# EAGLE design Transistors (EAGLE 6.1)
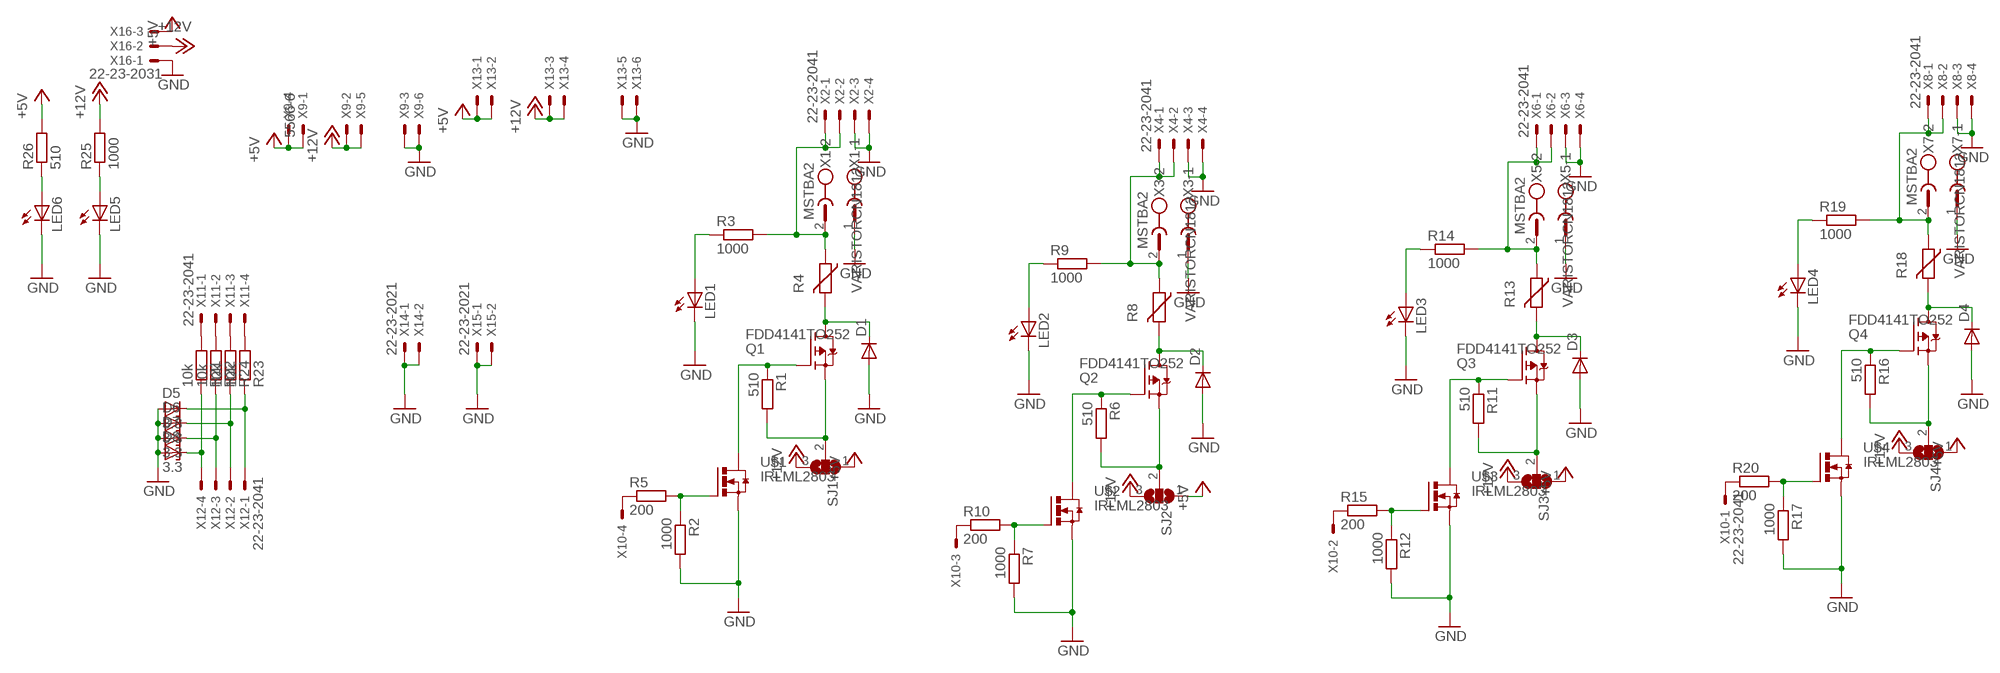
[diagram p0: schematic, sheet 1]

## Parts
D1  DIODE-SMB  [SMB]
D2  DIODE-SMB  [SMB]
D3  DIODE-SMB  [SMB]
D4  DIODE-SMB  [SMB]
D5  3.3  ZENER-DIODESOD80C  [SOD80C]
D6  3.3  ZENER-DIODESOD80C  [SOD80C]
D7  3.3  ZENER-DIODESOD80C  [SOD80C]
D8  3.3  ZENER-DIODESOD80C  [SOD80C]
LED1  LEDCHIPLED_1206  [CHIPLED_1206]
LED2  LEDCHIPLED_1206  [CHIPLED_1206]
LED3  LEDCHIPLED_1206  [CHIPLED_1206]
LED4  LEDCHIPLED_1206  [CHIPLED_1206]
LED5  LEDCHIPLED_1206  [CHIPLED_1206]
LED6  LEDCHIPLED_1206  [CHIPLED_1206]
Q1  FDD4141TO252  [TO252]
Q2  FDD4141TO252  [TO252]
Q3  FDD4141TO252  [TO252]
Q4  FDD4141TO252  [TO252]
R1  510  R-EU_M0805  [M0805]
R2  1000  R-EU_M0805  [M0805]
R3  1000  R-EU_M0805  [M0805]
R4  VARISTORCN1812  [CT/CN1812]
R5  200  R-EU_M0805  [M0805]
R6  510  R-EU_M0805  [M0805]
R7  1000  R-EU_M0805  [M0805]
R8  VARISTORCN1812  [CT/CN1812]
R9  1000  R-EU_M0805  [M0805]
R10  200  R-EU_M0805  [M0805]
R11  510  R-EU_M0805  [M0805]
R12  1000  R-EU_M0805  [M0805]
R13  VARISTORCN1812  [CT/CN1812]
R14  1000  R-EU_M0805  [M0805]
R15  200  R-EU_M0805  [M0805]
R16  510  R-EU_M0805  [M0805]
R17  1000  R-EU_M0805  [M0805]
R18  VARISTORCN1812  [CT/CN1812]
R19  1000  R-EU_M0805  [M0805]
R20  200  R-EU_M0805  [M0805]
R21  10k  R-EU_M0805  [M0805]
R22  10k  R-EU_M0805  [M0805]
R23  10k  R-EU_M0805  [M0805]
R24  10k  R-EU_M0805  [M0805]
R25  1000  R-EU_M0805  [M0805]
R26  510  R-EU_M0805  [M0805]
SJ1  SJ2W  [SJ_2]
SJ2  SJ2W  [SJ_2]
SJ3  SJ2W  [SJ_2]
SJ4  SJ2W  [SJ_2]
U$1  IRLML2803  [SUPER-SOT3]
U$2  IRLML2803  [SUPER-SOT3]
U$3  IRLML2803  [SUPER-SOT3]
U$4  IRLML2803  [SUPER-SOT3]
X1  MSTBA2  [MSTBA2]
X2  22-23-2041  [22-23-2041]
X3  MSTBA2  [MSTBA2]
X4  22-23-2041  [22-23-2041]
X5  MSTBA2  [MSTBA2]
X6  22-23-2041  [22-23-2041]
X7  MSTBA2  [MSTBA2]
X8  22-23-2041  [22-23-2041]
X9  5566-6  [5566-6]
X10  22-23-2041  [22-23-2041]
X11  22-23-2041  [22-23-2041]
X12  22-23-2041  [22-23-2041]
X13  22-23-2061  [22-23-2061]
X14  22-23-2021  [22-23-2021]
X15  22-23-2021  [22-23-2021]
X16  22-23-2031  [22-23-2031]

## Nets
+5V: R26.2 SJ1.1 SJ2.1 SJ3.1 SJ4.1 X9.1 X9.4 X13.1 X13.2 X16.3
+12V: R25.2 SJ1.3 SJ2.3 SJ3.3 SJ4.3 X9.2 X9.5 X13.3 X13.4 X16.2
GND: D1.A D2.A D3.A D4.A D5.A D6.A D7.A D8.A LED1.C LED2.C LED3.C LED4.C LED5.C LED6.C R2.2 R7.2 R12.2 R17.2 U$1.2(S) U$2.2(S) U$3.2(S) U$4.2(S) X1.1 X2.3 X2.4 X3.1 X4.3 X4.4 X5.1 X6.3 X6.4 X7.1 X8.3 X8.4 X9.3 X9.6 X13.5 X13.6 X14.1 X14.2 X15.1 X15.2 X16.1
N$1: Q1.2(S) R1.2 SJ1.2
N$2: Q1.1(G) R1.1 U$1.3(D)
N$3: R2.1 R5.2 U$1.1(G)
N$4: R5.1 X10.4
N$5: LED1.A R3.1
N$6: R10.1 X10.3
N$7: Q2.2(S) R6.2 SJ2.2
N$8: Q2.1(G) R6.1 U$2.3(D)
N$9: R7.1 R10.2 U$2.1(G)
N$10: R15.1 X10.2
N$11: R20.1 X10.1
N$12: LED2.A R9.1
N$13: Q3.2(S) R11.2 SJ3.2
N$14: Q3.1(G) R11.1 U$3.3(D)
N$15: R12.1 R15.2 U$3.1(G)
N$16: R21.2 X11.1
N$17: R22.2 X11.2
N$18: LED3.A R14.1
N$19: Q4.2(S) R16.2 SJ4.2
N$20: Q4.1(G) R16.1 U$4.3(D)
N$21: R17.1 R20.2 U$4.1(G)
N$22: R23.2 X11.4
N$23: R24.2 X11.3
N$24: LED4.A R19.1
N$26: LED6.A R26.1
N$27: LED5.A R25.1
N$29: D8.C R21.1 X12.4
N$30: D6.C R24.1 X12.2
N$32: D5.C R23.1 X12.1
N$33: D7.C R22.1 X12.3
OUT1: R3.2 R4.1 X1.2 X2.1 X2.2
OUT2: R8.1 R9.2 X3.2 X4.1 X4.2
OUT3: R13.1 R14.2 X5.2 X6.1 X6.2
OUT4: R18.1 R19.2 X7.2 X8.1 X8.2
TH1: D1.C Q1.3(D) R4.2
TH2: D2.C Q2.3(D) R8.2
TH3: D3.C Q3.3(D) R13.2
TH4: D4.C Q4.3(D) R18.2

## Library data of the parts
D1-D4 = diode:DIODE-: DIODE
D5-D8 = diode:ZENER-DIODE: Z-Diode
LED1-LED6 = led:LED: LED OSRAM: - CHIPLED LG R971, LG N971, LY N971, LG Q971, LY Q971, LO R971, LY R971 LH N974, LH R974 LS Q976, LO Q976, LY Q976 LO Q996 - Hyper CHIPLED LW Q18S LB Q993, LB Q99A, LB R99A - SideLED LS A670, LO A670, LY A670, LG A670, LP A670 LB A673, LV A673, LT A673, LW A673 LH A674 LY A675 LS A676, LA A676, LO A676, LY A676, LW A676 LS A679, LY A679, LG A679 - Hyper Micro SIDELED® LS Y876, LA Y876, LO Y876, LY Y876 LT Y87S - SmartLED LW L88C, LW L88S LB L89C, LB L89S, LG L890 LS L89K, LO L89K, LY L89K LS L896, LA L896, LO L896, LY L896 - TOPLED LS T670, LO T670, LY T670, LG T670, LP T670 LSG T670, LSP T670, LSY T670, LOP T670, LYG T670 LG T671, LOG T671, LSG T671 LB T673, LV T673, LT T673, LW T673 LH T674 LS T676, LA T676, LO T676, LY T676, LB T676, LH T676, LSB T676, LW T676 LB T67C, LV T67C, LT T67C, LS T67K, LO T67K, LY T67K, LW E67C LS E67B, LA E67B, LO E67B, LY E67B, LB E67C, LV E67C, LT E67C LW T67C LS T679, LY T679, LG T679 LS T770, LO T770, LY T770, LG T770, LP T770 LB T773, LV T773, LT T773, LW T773 LH T774 LS E675, LA E675, LY E675, LS T675 LS T776, LA T776, LO T776, LY T776, LB T776 LHGB T686 LT T68C, LB T68C - Hyper Mini TOPLED® LB M676 - Mini TOPLED Santana® LG M470 LS M47K, LO M47K, LY M47K Source: http://www.osram.convergy.de LUXEON: - LUMILED® LXK2-PW12-R00, LXK2-PW12-S00, LXK2-PW14-U00, LXK2-PW14-V00 LXK2-PM12-R00, LXK2-PM12-S00, LXK2-PM14-U00 LXK2-PE12-Q00, LXK2-PE12-R00, LXK2-PE12-S00, LXK2-PE14-T00, LXK2-PE14-U00 LXK2-PB12-K00, LXK2-PB12-L00, LXK2-PB12-M00, LXK2-PB14-N00, LXK2-PB14-P00, LXK2-PB14-Q00 LXK2-PR12-L00, LXK2-PR12-M00, LXK2-PR14-Q00, LXK2-PR14-R00 LXK2-PD12-Q00, LXK2-PD12-R00, LXK2-PD12-S00 LXK2-PH12-R00, LXK2-PH12-S00 LXK2-PL12-P00, LXK2-PL12-Q00, LXK2-PL12-R00 Source: www.luxeon.com KINGBRIGHT: KA-3528ASYC Source: www.kingbright.com
Q1-Q4 = transistor-fet:FDD4141: P-Channel PowerTrench® MOSFET Source: FDD4141.pdf
R1-R3 R5-R7 R9-R12 R14-R17 R19-R26 = rcl:R-EU_: RESISTOR, European symbol
R4 R8 R13 R18 = varistor:VARISTOR: VARISTOR
SJ1-SJ4 = jumper:SJ2W: SMD solder JUMPER
U$1-U$4 = transistor-power:IRLML2803
X1 X3 X5 X7 = con-phoenix-508:MSTBA2: PHOENIX; MF: FARNELL; MPN: 1757242; OC_FARNELL: 3705171; OC_NEWARK: 71C4161
X2 X4 X6 X8 X10-X12 = con-molex:22-23-2041: .100" (2.54mm) Center Header - 4 Pin; MF: MOLEX; MPN: 22-23-2041; OC_FARNELL: 1462920; OC_NEWARK: 38C0355
X9 = con-molex:5566-6: Mini FIT connector 6 pol Source: http://www.molex.com; MPN: 95566-61002; OC_FARNELL: unknown; OC_NEWARK: 22K8620
X13 = con-molex:22-23-2061: .100" (2.54mm) Center Header - 6 Pin; MF: MOLEX; MPN: 22-23-2061; OC_FARNELL: 1462922; OC_NEWARK: 27C1933
X14 X15 = con-molex:22-23-2021: .100" (2.54mm) Center Header - 2 Pin; MF: MOLEX; MPN: 22-23-2021; OC_FARNELL: 1462926; OC_NEWARK: 25C3832
X16 = con-molex:22-23-2031: .100" (2.54mm) Center Header - 3 Pin; MF: MOLEX; MPN: 22-23-2031; OC_FARNELL: 1462950; OC_NEWARK: 30C0862

## Board
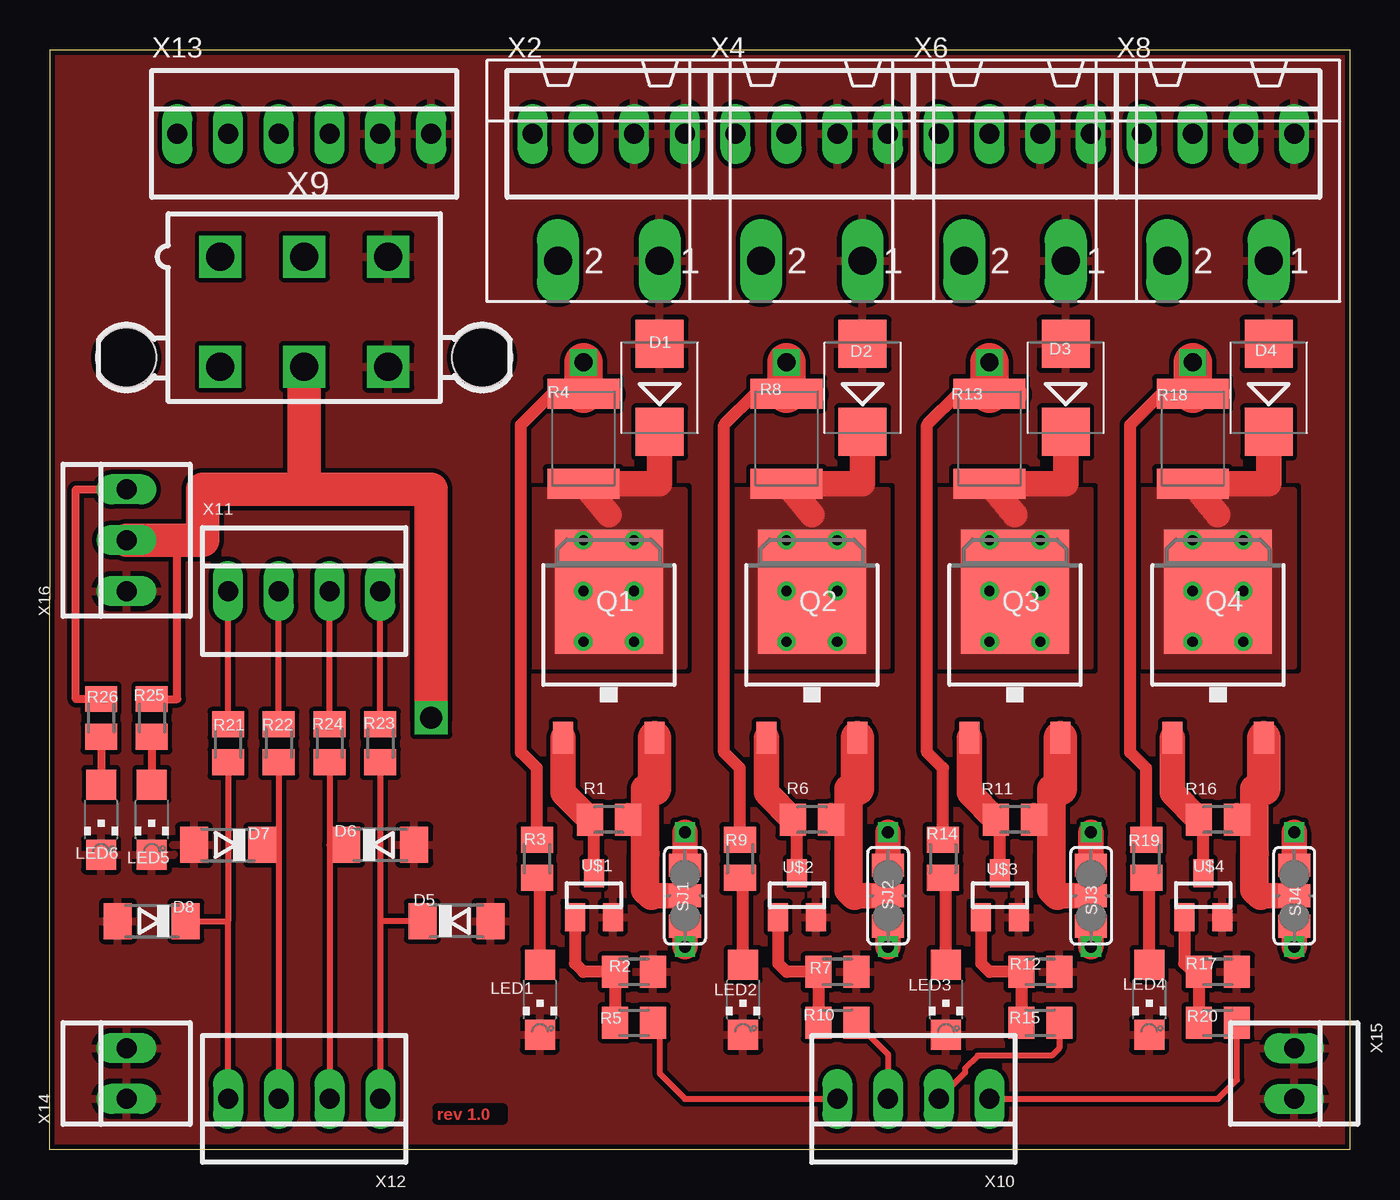
[diagram p1: board, top side]
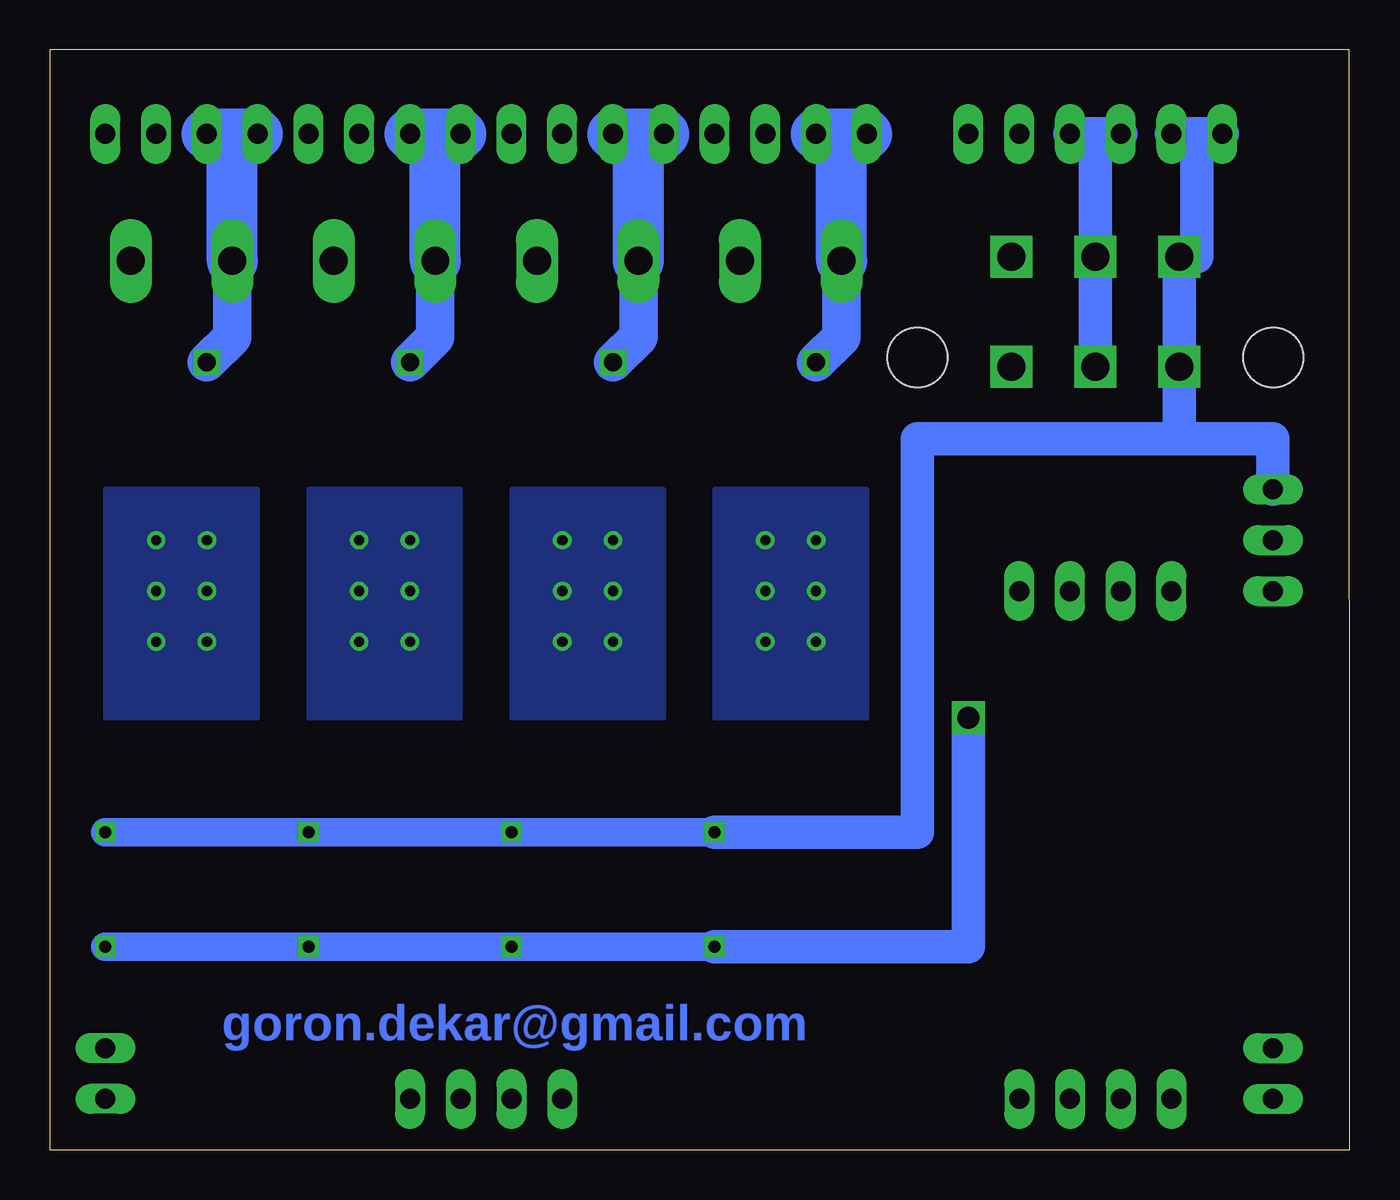
[diagram p2: board, bottom side, seen from below]

Size 65.02 x 55 mm. Coordinates in mm from the lower left corner, seen from the top.
Outline: 65.02,0 0,0 0.02,55 65.02,55 65.02,0
Copper layers (1+16): Top 0.0178mm / dielectric 1.5011mm / Bottom 0.0178mm
Design rules: minimum track width 0.22mm, minimum drill 0.3mm, track to track 0.22mm, track to pad 0.22mm, pad to pad 0.22mm, via to via 0.22mm, smd to smd 0mil, copper to edge 0.25mm, drill to drill 0.22mm, minimum pad ring 10mil, minimum via ring 8mil, stop-mask expansion 4mil, vias tented up to drill 0.5mm, thermal gap 10mil

### Footprints (pad centres in the part's own frame; a part is rotated, then mirrored left to right if it is on the bottom)
SMB = smd 2.4 x 2.4: A 2.2,0; C -2.2,0
SOD80C = smd 1.4 x 1.8: A 1.7,0; C -1.7,0
CHIPLED_1206 = smd 1.5 x 1.5: A 0,-1.75; C 0,1.75
TO252 = smd 1 x 1.6: 1 -2.28,-4.8; 2 2.28,-4.8 | smd 5.4 x 6.2: 3 0,2.5
M0805 = smd 1.3 x 1.6: 1 -0.95,0; 2 0.95,0
CT/CN1812 = smd 1.5 x 3.6: 1 -2.25,0; 2 2.25,0
SJ_2 = smd 1.168 x 1.6: 1 -1.524,0; 2 0,0; 3 1.524,0
SUPER-SOT3 = smd 1 x 1.4: 1 -0.95,-1.1; 2 0.95,-1.1; 3 0,1.1
MSTBA2 = drill 1.397 long: 1 -2.54,5.08; 2 2.54,5.08
22-23-2041 = drill 1 long: 1 -3.81,0; 2 -1.27,0; 3 1.27,0; 4 3.81,0
5566-6 = drill 1.4 square: 1 4.2,-2.75; 2 0,-2.75; 3 -4.2,-2.75; 4 4.2,2.75; 5 0,2.75; 6 -4.2,2.75 | hole 3: 8.9,2.29; -8.9,2.29
22-23-2061 = drill 1 long: 1 -6.35,0; 2 -3.81,0; 3 -1.27,0; 4 1.27,0; 5 3.81,0; 6 6.35,0
22-23-2021 = drill 1 long: 1 -1.27,0; 2 1.27,0
22-23-2031 = drill 1 long: 1 -2.54,0; 2 0,0; 3 2.54,0

### Placement (x,y rotation side)
D1  30.5,38.1 90 top
D2  40.66,38.1 90 top
D3  50.82,38.1 90 top
D4  60.98,38.1 90 top
D5  20.34,11.43 0 top
D6  16.53,15.24 0 top
D7  8.91,15.24 180 top
D8  5.1,11.43 180 top
LED1  24.51,7.5 180 top
LED2  34.67,7.5 180 top
LED3  44.83,7.5 180 top
LED4  54.99,7.5 180 top
LED5  5.1,16.51 180 top
LED6  2.56,16.51 180 top
Q1  27.96,25.4 0 top
Q2  38.12,25.4 0 top
Q3  48.28,25.4 0 top
Q4  58.44,25.4 0 top
R1  27.96,16.51 0 top
R2  29.23,8.89 0 top
R3  24.36,14.55 90 top
R4  26.69,35.56 270 top
R5  29.23,6.35 180 top
R6  38.12,16.51 0 top
R7  39.39,8.89 0 top
R8  36.85,35.56 270 top
R9  34.52,14.55 90 top
R10  39.39,6.35 180 top
R11  48.28,16.51 0 top
R12  49.55,8.89 0 top
R13  47.01,35.56 270 top
R14  44.68,14.55 90 top
R15  49.55,6.35 180 top
R16  58.44,16.51 0 top
R17  58.44,8.89 0 top
R18  57.17,35.56 270 top
R19  54.84,14.55 90 top
R20  58.44,6.35 180 top
R21  8.91,20.32 90 top
R22  11.45,20.32 90 top
R23  16.53,20.32 90 top
R24  13.99,20.32 90 top
R25  5.1,21.59 90 top
R26  2.56,21.59 90 top
SJ1  31.77,12.7 270 top
SJ2  41.93,12.7 270 top
SJ3  52.09,12.7 270 top
SJ4  62.25,12.7 270 top
U$1  27.22,12.73 0 top
U$2  37.38,12.73 0 top
U$3  47.54,12.73 0 top
U$4  57.7,12.73 0 top
X1  27.96,49.53 180 top
X2  27.96,50.8 0 top
X3  38.12,49.53 180 top
X4  38.12,50.8 0 top
X5  48.28,49.53 180 top
X6  48.28,50.8 0 top
X7  58.44,49.53 180 top
X8  58.44,50.8 0 top
X9  12.72,41.91 180 top
X10  43.2,2.54 180 top
X11  12.72,27.94 0 top
X12  12.72,2.54 180 top
X13  12.72,50.8 0 top
X14  3.83,3.81 90 top
X15  62.25,3.81 270 top
X16  3.83,30.48 90 top

### Tracks (layer width: path | path; a pad name or v marks a point on that pad's centre or on a via)
+5V  (via drill 0.6)
  Top 0.406: R26.2 1.29,22.54 1.29,33.02 X16.3
  Top 1.27: SJ1.1 v31.77,15.88 | v62.25,15.88 SJ4.1 | SJ3.1 v52.09,15.88 | SJ2.1 v41.93,15.88
  Bottom 1.422: v31.77,15.88 v41.93,15.88 v52.09,15.88 v62.25,15.88
  Bottom 1.676: 7.64,50.8 7.64,44.66 X9.1 X9.4 8.52,35.56 | 7.64,50.8 X13.1 | X13.2 7.64,50.8 | v31.77,15.88 21.61,15.88 21.61,35.56 8.52,35.56 | X16.3 3.83,35.56 8.52,35.56
+12V  (via drill 0.6, 1.1)
  Top 0.406: R25.2 6.37,22.54 6.37,30.48
  Top 1.27: SJ1.3 v31.77,10.16 | SJ2.3 v41.93,10.16 | SJ3.3 v52.09,10.16 | SJ4.3 v62.25,10.16
  Top 1.676: X9.5 12.72,33.02 | 12.72,33.02 19.07,33.02 v19.07,21.59 | X16.2 6.37,30.48 7.64,30.48 7.64,33.02 12.72,33.02
  Bottom 1.422: v52.09,10.16 v41.93,10.16 v31.77,10.16 v52.09,10.16 | v62.25,10.16 v52.09,10.16
  Bottom 1.676: X9.5 X9.2 12.72,50.8 | X13.3 12.72,50.8 | X13.4 12.72,50.8 | v19.07,21.59 19.07,10.16 v31.77,10.16
GND
  pour Top (rank 2): 0.02,55 65.02,55 65.02,0 0.02,0
N$1
  Top 0.406: R1.2 29.78,16.51
  Top 1.27: R1.2 28.91,16.71 | SJ1.2 30.09,12.7
  Top 1.422: 30.09,12.7 29.78,13.01 29.78,14.8 | 29.78,14.8 29.79,14.81 | 29.78,14.8 29.78,16.51 29.78,18.04 30.24,18.04
  Top 1.676: Q1.2 30.24,18.04
N$2
  Top 0.61: U$1.3 27.22,16.3 R1.1
  Top 1.27: Q1.1 25.68,17.84 R1.1
N$3
  Top 0.61: U$1.1 26.27,9.31 26.69,8.89 R2.1 R5.2
N$4
  Top 0.305: R5.1 30.5,6.03 30.5,3.81 31.77,2.54 X10.4
N$5
  Top 0.61: LED1.A 24.51,13.45 R3.1
N$6
  Top 0.305: R10.1 41.93,4.76 X10.3
N$7
  Top 0.406: R6.2 39.94,16.51
  Top 1.27: R6.2 39.07,16.71 | SJ2.2 40.25,12.7
  Top 1.422: 40.25,12.7 39.94,13.01 39.94,14.8 | 39.94,14.8 39.95,14.81 | 39.94,14.8 39.94,16.51 39.94,18.04 40.4,18.04
  Top 1.676: Q2.2 40.4,18.04
N$8
  Top 0.61: U$2.3 37.38,16.3 R6.1
  Top 1.27: Q2.1 35.84,17.84 R6.1
N$9
  Top 0.61: U$2.1 36.43,9.31 36.85,8.89 R7.1 R10.2
N$10
  Top 0.305: R15.1 50.5,5.08 50.13,4.71 46.43,4.71 45.78,4.07 45.78,3.85 X10.2
N$11
  Top 0.305: X10.1 58.44,2.54 59.39,3.49 R20.1
N$12
  Top 0.61: LED2.A 34.67,13.45 R9.1
N$13
  Top 0.406: R11.2 50.1,16.51
  Top 1.27: R11.2 49.23,16.71 | SJ3.2 50.41,12.7
  Top 1.422: 50.41,12.7 50.1,13.01 50.1,14.8 | 50.1,14.8 50.11,14.81 | 50.1,14.8 50.1,16.51 50.1,18.04 50.56,18.04
  Top 1.676: Q3.2 50.56,18.04
N$14
  Top 0.61: U$3.3 47.54,16.3 R11.1
  Top 1.27: Q3.1 46,17.84 R11.1
N$15
  Top 0.61: U$3.1 46.59,9.31 47.01,8.89 R12.1 R15.2
N$16
  Top 0.305: R21.2 X11.1
N$17
  Top 0.305: R22.2 X11.2
N$18
  Top 0.61: LED3.A 44.83,13.45 R14.1
N$19
  Top 0.406: R16.2 60.26,16.51
  Top 1.27: R16.2 59.39,16.71 | SJ4.2 60.57,12.7
  Top 1.422: 60.57,12.7 60.26,13.01 60.26,14.8 | 60.26,14.8 60.27,14.81 | 60.26,14.8 60.26,16.51 60.26,18.04 60.72,18.04
  Top 1.676: Q4.2 60.72,18.04
N$20
  Top 0.61: U$4.3 57.7,16.3 R16.1
  Top 1.27: Q4.1 56.16,17.84 R16.1
N$21
  Top 0.61: U$4.1 56.75,9.31 57.17,8.89 R17.1 R20.2
N$22
  Top 0.305: R23.2 X11.4
N$23
  Top 0.305: R24.2 X11.3
N$24
  Top 0.61: LED4.A 54.99,13.45 R19.1
N$26
  Top 0.406: R26.1 LED6.A
N$27
  Top 0.406: R25.1 LED5.A
N$29
  Top 0.305: R21.1 8.91,11.43 | D8.C 8.91,11.43 | X12.4 8.91,11.43
N$30
  Top 0.305: R24.1 13.99,15.24 | 13.99,15.24 X12.2 | D6.C 13.99,15.24
N$32
  Top 0.305: R23.1 16.53,11.43 | 16.53,11.43 X12.1 | D5.C 16.53,11.43
N$33
  Top 0.305: R22.1 11.45,15.24 | 11.45,15.24 X12.3 | D7.C 11.45,15.24
OUT1  (via drill 0.9)
  Top 0.61: R3.2 24.36,19.08 23.57,19.87 23.57,36.24 25.13,37.81 R4.1
  Top 1.27: R4.1 27.96,37.78
  Top 1.93: R4.1 v26.69,39.37
  Bottom 1.93: v26.69,39.37 25.42,40.64 X1.2
  Bottom 2.54: X2.2 25.42,50.8 | 25.42,50.8 X2.1 | X1.2 25.42,50.8
OUT2  (via drill 0.9)
  Top 0.61: R9.2 34.52,19.08 33.73,19.87 33.73,36.24 35.29,37.81 R8.1
  Top 1.27: R8.1 38.12,37.78
  Top 1.93: R8.1 v36.85,39.37
  Bottom 1.93: v36.85,39.37 35.58,40.64 X3.2
  Bottom 2.54: X4.2 35.58,50.8 | 35.58,50.8 X4.1 | X3.2 35.58,50.8
OUT3  (via drill 0.9)
  Top 0.61: R14.2 44.68,19.08 43.89,19.87 43.89,36.24 45.45,37.81 R13.1
  Top 1.27: R13.1 48.28,37.78
  Top 1.93: R13.1 v47.01,39.37
  Bottom 1.93: v47.01,39.37 45.74,40.64 X5.2
  Bottom 2.54: X6.2 45.74,50.8 | 45.74,50.8 X6.1 | X5.2 45.74,50.8
OUT4  (via drill 0.9)
  Top 0.61: R19.2 54.84,19.08 54.05,19.87 54.05,36.24 55.61,37.81 R18.1
  Top 1.27: R18.1 58.44,37.78
  Top 1.93: R18.1 v57.17,39.37
  Bottom 1.93: v57.17,39.37 55.9,40.64 X7.2
  Bottom 2.54: X8.2 55.9,50.8 | 55.9,50.8 X8.1 | X7.2 55.9,50.8
TH1  (via drill 0.51)
  Top 1.27: 27.96,31.75 R4.2 30.5,33.31 D1.C
  other vias: 26.69,27.94 29.23,27.94 29.23,30.48 26.69,30.48 26.69,25.4 29.23,25.4
  pour Bottom: 24.15,33.02 31.77,33.02 31.77,21.59 24.15,21.59
  pour Top (no thermals): 24.15,33.02 31.77,33.02 31.77,24.13 24.15,24.13
TH2  (via drill 0.51)
  Top 1.27: 38.12,31.75 R8.2 40.66,33.31 D2.C
  other vias: 36.85,27.94 39.39,27.94 39.39,30.48 36.85,30.48 36.85,25.4 39.39,25.4
  pour Top (no thermals): 34.31,33.02 41.93,33.02 41.93,24.13 34.31,24.13
  pour Bottom: 34.31,33.02 41.93,33.02 41.93,21.59 34.31,21.59
TH3  (via drill 0.51)
  Top 1.27: 48.28,31.75 R13.2 50.82,33.31 D3.C
  other vias: 47.01,27.94 49.55,27.94 49.55,30.48 47.01,30.48 47.01,25.4 49.55,25.4
  pour Top (no thermals): 44.47,33.02 52.09,33.02 52.09,24.13 44.47,24.13
  pour Bottom: 44.47,33.02 52.09,33.02 52.09,21.59 44.47,21.59
TH4  (via drill 0.51)
  Top 1.27: 58.44,31.75 R18.2 60.98,33.31 D4.C
  other vias: 57.17,27.94 59.71,27.94 59.71,30.48 57.17,30.48 57.17,25.4 59.71,25.4
  pour Top (no thermals): 54.63,33.02 62.25,33.02 62.25,24.13 54.63,24.13
  pour Bottom: 54.63,33.02 62.25,33.02 62.25,21.59 54.63,21.59

### Text on the board
Top: rev 1.0
Bottom: goron.dekar@gmail.com